# EAGLE design Teensy_FrequencyShield_2ch_slim (EAGLE 6.6.0)
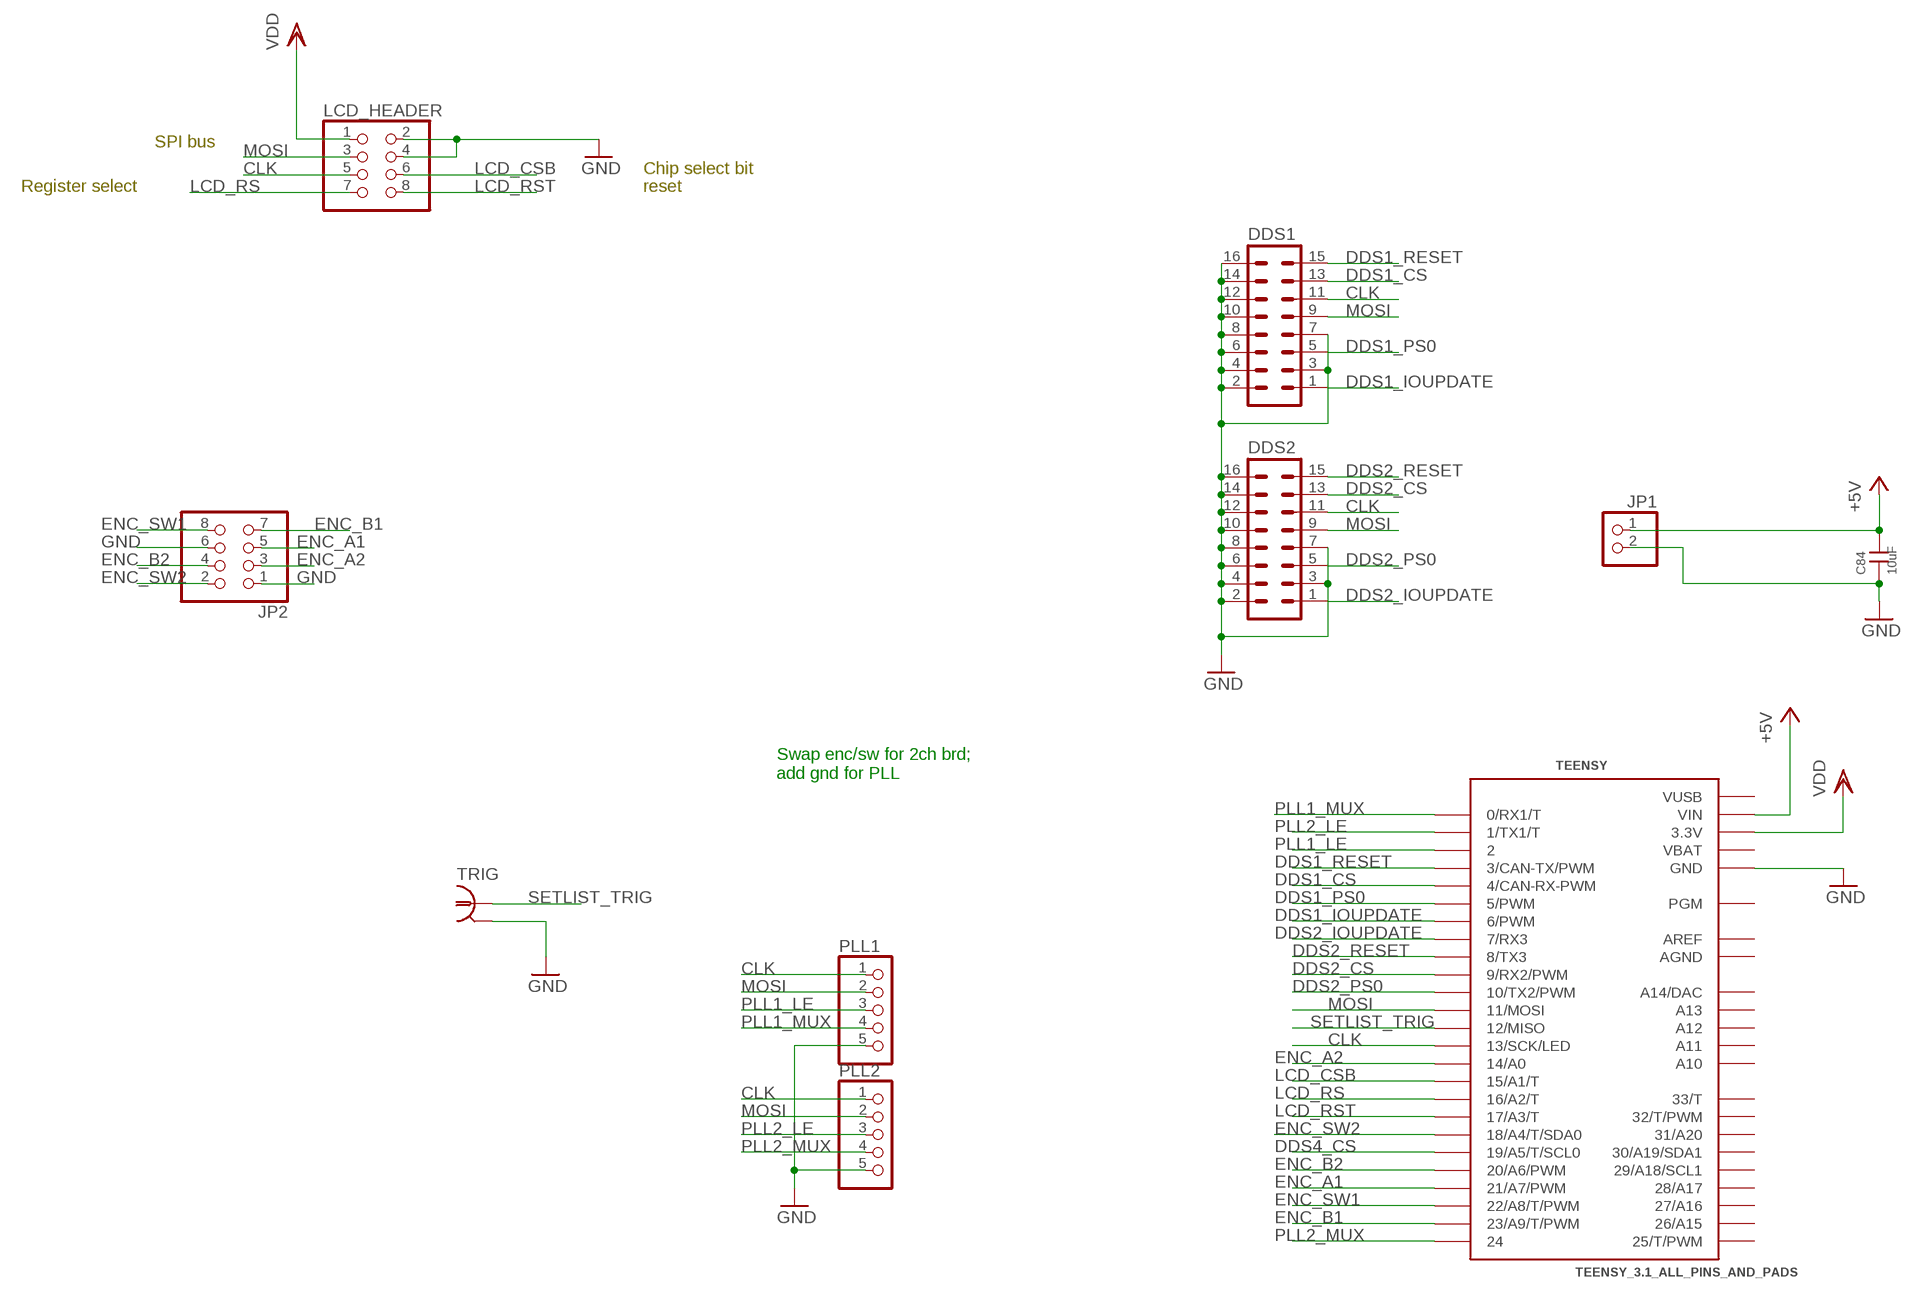
[diagram p0: schematic, sheet 1]

## Parts
C84  10uF  CAP0805  [0805]
DDS1  ML16  [ML16]
DDS2  ML16  [ML16]
JP1  PINHD-1X2  [1X02]
JP2  PINHD-2X4-SHROUD  [ML08]
LCD_HEADER  PINHD-2X4-SHROUD  [ML08]
PLL1  PINHD-1X5  [1X05]
PLL2  PINHD-1X5  [1X05]
TEENSY  TEENSY_3.1_ALL_PINS_AND_PADS  [TEENSY_3.1_ALLPINS]
TRIG  BNC-H  [BNC90]

## Nets
+5V: C84.2 JP1.1 TEENSY.VIN
CLK: DDS1.11 DDS2.11 LCD_HEADER.5 PLL1.1 PLL2.1 TEENSY.13(13/SCK/LED)
DDS1_CS: DDS1.13 TEENSY.4(4/CAN-RX-PWM)
DDS1_IOUPDATE: DDS1.1 TEENSY.6(6/PWM)
DDS1_PS0: DDS1.5 TEENSY.5(5/PWM)
DDS1_RESET: DDS1.15 TEENSY.3(3/CAN-TX/PWM)
DDS2_CS: DDS2.13 TEENSY.9(9/RX2/PWM)
DDS2_IOUPDATE: DDS2.1 TEENSY.7(7/RX3)
DDS2_PS0: DDS2.5 TEENSY.10(10/TX2/PWM)
DDS2_RESET: DDS2.15 TEENSY.8(8/TX3)
DDS4_CS: TEENSY.19/A5(19/A5/T/SCL0)
ENC_A1: JP2.5 TEENSY.21/A7(21/A7/PWM)
ENC_A2: JP2.3 TEENSY.14/A0
ENC_B1: JP2.7 TEENSY.23/A9(23/A9/T/PWM)
ENC_B2: JP2.4 TEENSY.20/A6(20/A6/PWM)
ENC_SW1: JP2.8 TEENSY.22/A8(22/A8/T/PWM)
ENC_SW2: JP2.2 TEENSY.18/A4(18/A4/T/SDA0)
EROU: LCD_HEADER.1 TEENSY.3.3V TEENSY.3.3V1(3.3V) TEENSY.3.3V2(3.3V) ; supply symbol labelled VDD
GND: C84.1 DDS1.2 DDS1.3 DDS1.4 DDS1.6 DDS1.7 DDS1.8 DDS1.10 DDS1.12 DDS1.14 DDS1.16 DDS2.2 DDS2.3 DDS2.4 DDS2.6 DDS2.7 DDS2.8 DDS2.10 DDS2.12 DDS2.14 DDS2.16 JP1.2 JP2.1 JP2.6 LCD_HEADER.2 LCD_HEADER.4 PLL1.5 PLL2.5 TEENSY.GND TEENSY.GND1(GND) TEENSY.GND2(GND) TRIG.2
LCD_CSB: LCD_HEADER.6 TEENSY.15/A1(15/A1/T)
LCD_RS: LCD_HEADER.7 TEENSY.16/A2(16/A2/T)
LCD_RST: LCD_HEADER.8 TEENSY.17/A3(17/A3/T)
MOSI: DDS1.9 DDS2.9 LCD_HEADER.3 PLL1.2 PLL2.2 TEENSY.11(11/MOSI)
PLL1_LE: PLL1.3 TEENSY.2
PLL1_MUX: PLL1.4 TEENSY.0(0/RX1/T)
PLL2_LE: PLL2.3 TEENSY.1(1/TX1/T)
PLL2_MUX: PLL2.4 TEENSY.24
SETLIST_TRIG: TEENSY.12(12/MISO) TRIG.1
Unconnected: TEENSY.25(25/T/PWM) TEENSY.26(26/A15) TEENSY.27(27/A16) TEENSY.28(28/A17) TEENSY.29(29/A18/SCL1) TEENSY.30(30/A19/SDA1) TEENSY.31(31/A20) TEENSY.32(32/T/PWM) TEENSY.33(33/T) TEENSY.A10 TEENSY.A11 TEENSY.A12 TEENSY.A13 TEENSY.A14(A14/DAC) TEENSY.PGM

## Notes on the sheet
- SPI bus
- Chip select bit
- Register select | reset
- Swap enc/sw for 2ch brd;
  add gnd for PLL

## Power pins joined to a net without a drawn wire
AGND: TEENSY.AGND
AREF: TEENSY.AREF
VBAT: TEENSY.VBAT
VUSB: TEENSY.VUSB

## Library data of the parts
C84 = rlc-jqi:CAP: SMT Capacitor; PARTNO: 1276-2890-1-ND
DDS1 DDS2 = mcu-accessories:ML16: HARTING 2x8 (16 pin) ribbon connector.; OC_FARNELL: unknown; OC_NEWARK: unknown
JP1 = pinhead:PINHD-1X2: PIN HEADER
JP2 LCD_HEADER = mcu-accessories:PINHD-2X4: PIN HEADER
PLL1 PLL2 = pinhead:PINHD-1X5: PIN HEADER
TEENSY = mcu-accessories:TEENSY_3.1_ALL_PINS_AND_PADS: Footprint for Teensy 3.1 board using all pads and all through-holes. Pads need a 2x7 0.1" SMD header.
TRIG = connector-jqi:BNC: BNC Connector.; DIGIKEY: 12345

## Board
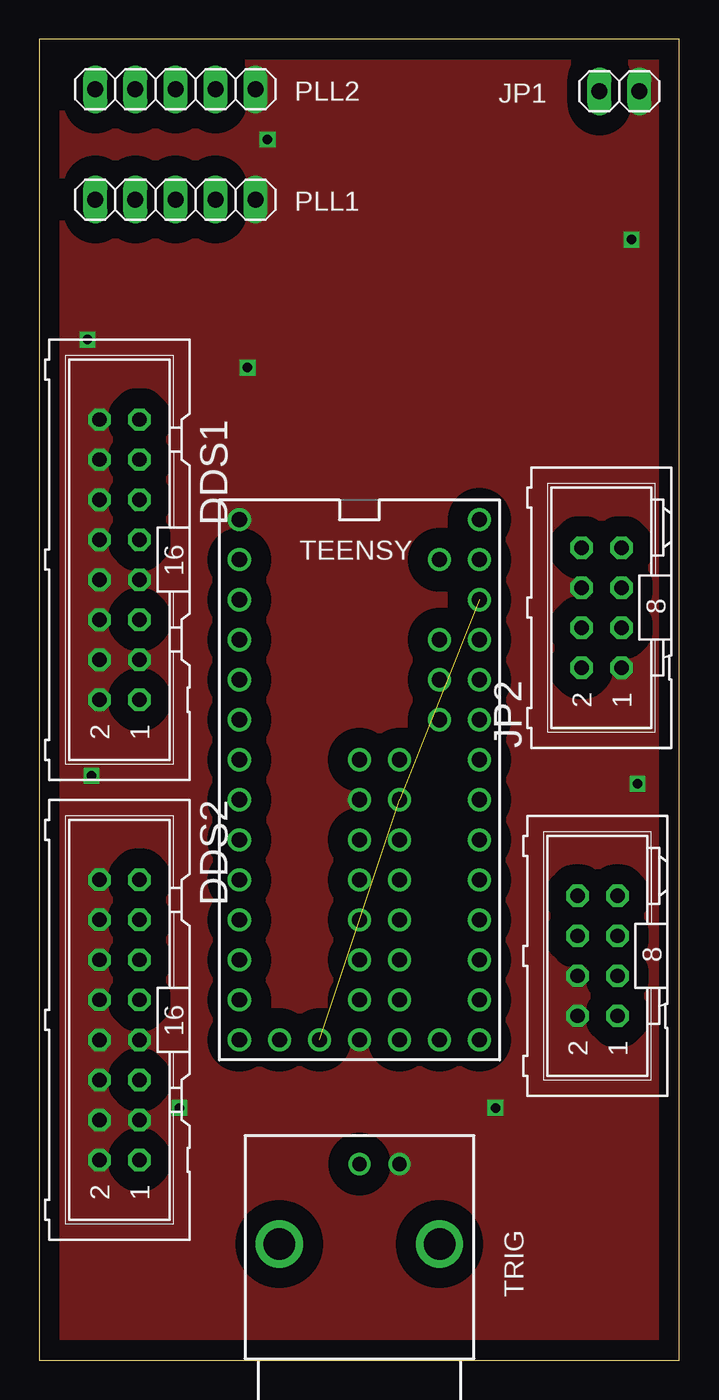
[diagram p1: board, top side]
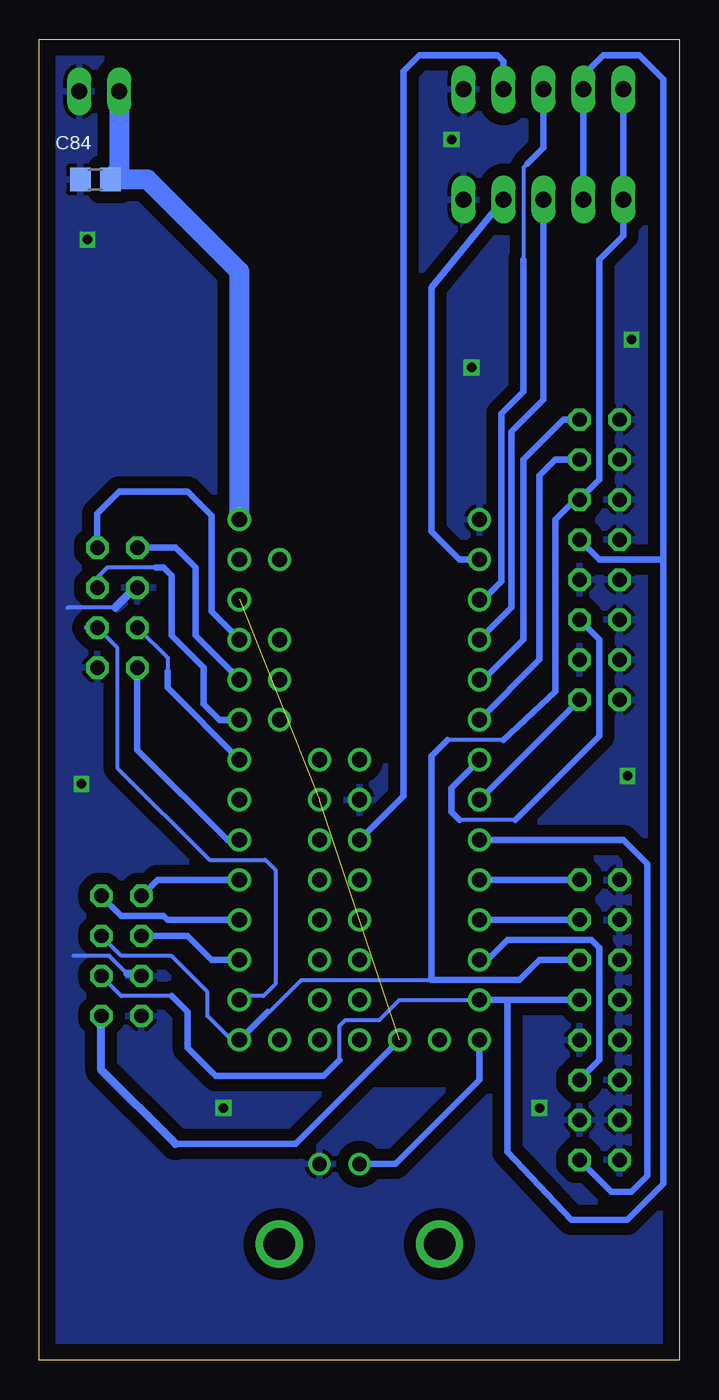
[diagram p2: board, bottom side, seen from below]

Size 40.64 x 83.82 mm. Coordinates in mm from the lower left corner, seen from the top.
Outline: 0,0 40.64,0 40.64,83.82 0,83.82 0,0
Copper layers (1*16): Top 0.035mm / dielectric 1.5mm / Bottom 0.035mm
Design rules "default": minimum track width 10mil, minimum drill 24mil, track to track 8mil, track to pad 8mil, pad to pad 8mil, via to via 8mil, smd to smd 8mil, copper to edge 40mil, drill to drill 8mil, minimum pad ring 10mil, minimum via ring 8mil, stop-mask expansion 4mil, vias tented up to drill 0mil, thermal gap 10mil

### Footprints (pad centres in the part's own frame; a part is rotated, then mirrored left to right if it is on the bottom)
0805 = smd 1.3 x 1.5: 1 -0.95,0; 2 0.95,0
ML16 = drill 0.914 octagon: 1 -8.89,-1.27; 2 -8.89,1.27; 3 -6.35,-1.27; 4 -6.35,1.27; 5 -3.81,-1.27; 6 -3.81,1.27; 7 -1.27,-1.27; 8 -1.27,1.27; 9 1.27,-1.27; 10 1.27,1.27; 11 3.81,-1.27; 12 3.81,1.27; 13 6.35,-1.27; 14 6.35,1.27; 15 8.89,-1.27; 16 8.89,1.27
1X02 = drill 1.016 long: 1 -1.27,0; 2 1.27,0
ML08 = drill 0.914 octagon: 1 -3.81,-1.143; 2 -3.81,1.397; 3 -1.27,-1.143; 4 -1.27,1.397; 5 1.27,-1.143; 6 1.27,1.397; 7 3.81,-1.143; 8 3.81,1.397
1X05 = drill 1.016 long: 1 -5.08,0; 2 -2.54,0; 3 0,0; 4 2.54,0; 5 5.08,0
TEENSY_3.1_ALLPINS = drill 0.965: 0 -7.62,15.24; 1 -7.62,12.7; 2 -7.62,10.16; 3 -7.62,7.62; 3.3V 7.62,12.7; 3.3V1 -2.54,-15.24; 3.3V2 2.54,0; 4 -7.62,5.08; 5 -7.62,2.54; 6 -7.62,0; 7 -7.62,-2.54; 8 -7.62,-5.08; 9 -7.62,-7.62; 10 -7.62,-10.16; 11 -7.62,-12.7; 12 -7.62,-15.24; 13 7.62,-15.24; 14/A0 7.62,-12.7; 15/A1 7.62,-10.16; 16/A2 7.62,-7.62; 17/A3 7.62,-5.08; 18/A4 7.62,-2.54; 19/A5 7.62,0; 20/A6 7.62,2.54; 21/A7 7.62,5.08; 22/A8 7.62,7.62; 23/A9 7.62,10.16; 24 0,-2.54; 25 0,-5.08; 26 0,-7.62; 27 0,-10.16; 28 0,-12.7; 29 2.54,-12.7; 30 2.54,-10.16; 31 2.54,-7.62; 32 2.54,-5.08; 33 2.54,-2.54; A10 5.08,7.62; A11 5.08,5.08; A12 0,2.54; A13 2.54,2.54; A14 5.08,-15.24; AGND 7.62,15.24; AREF 5.08,10.16; GND -7.62,17.78; GND1 0,-15.24; GND2 0,0; PGM 2.54,-15.24; VBAT -5.08,-15.24; VIN 7.62,17.78; VUSB 5.08,15.24
BNC90 = drill 0.9 pad 1.27: 1 0,-5.08; 2 -2.54,-5.08 | drill 2 pad 2.032: ANCHOR1 -5.08,0; ANCHOR2 5.08,0

### Placement (x,y rotation side)
C84  37.08,74.93 0 bottom
DDS1  5.08,50.8 90 top
DDS2  5.08,21.59 90 top
JP1  36.83,80.52 0 top
JP2  35.81,47.75 90 top
LCD_HEADER  35.56,25.65 90 top
PLL1  8.64,73.66 0 top
PLL2  8.64,80.64 0 top
TEENSY  20.32,35.56 0 top
TRIG  20.32,7.37 180 top

### Tracks (layer width: path | path; a pad name or v marks a point on that pad's centre or on a via)
+5V
  Bottom 1.27: TEENSY.VIN 27.94,69.09 33.78,74.93 C84.2 35.56,75.5 JP1.1
CLK
  Bottom 0.254: 11.18,39.37 14.73,39.37 | TEENSY.13 28.45,20.32 29.97,21.84 29.97,23.37 32.26,25.65 35.43,25.65 LCD_HEADER.5 | 26.16,22.1 26.04,22.1 24,24.13 15.75,24.13
  Bottom 0.406: PLL2.1 PLL1.1 3.56,71.37 5.08,69.85 5.08,55.88 DDS1.11 6.6,54.61 7.87,53.34 7.87,42.42 11.18,39.37 | DDS2.11 8.89,25.4 10.16,24.13 15.75,24.13 15.75,38.35 14.73,39.37 | 26.16,22.1 TEENSY.13
DDS1_CS
  Bottom 0.406: TEENSY.4 8.89,44.45 8.89,56.13 7.87,57.15 DDS1.13
DDS1_IOUPDATE
  Bottom 0.406: DDS1.1 TEENSY.6
DDS1_PS0
  Bottom 0.254: 10.41,34.29 13.97,34.29
  Bottom 0.406: DDS1.5 5.08,45.72 5.08,39.62 10.41,34.29 | 13.97,34.29 14.48,34.8 14.48,36.32 TEENSY.5
DDS1_RESET
  Bottom 0.406: TEENSY.3 12.45,43.18 9.91,45.72 9.91,57.15 7.37,59.69 DDS1.15
DDS2_CS
  Bottom 0.406: DDS2.13 TEENSY.9
DDS2_IOUPDATE
  Bottom 0.406: TEENSY.7 3.56,33.02 2.03,31.5 2.03,11.68 3.05,10.67 4.32,10.67 DDS2.1
DDS2_PS0
  Bottom 0.406: TEENSY.10 12.19,25.4 10.92,26.67 5.59,26.67 5.08,26.16 5.08,19.05 DDS2.5
DDS2_RESET
  Bottom 0.406: DDS2.15 TEENSY.8
ENC_A1
  Bottom 0.254: 33.27,50.29 36.32,50.29 36.96,49.66 JP2.5
  Bottom 0.406: 28.19,40.64 TEENSY.21/A7 29.21,40.64 30.23,41.66 30.23,43.94 32.26,45.97 32.26,49.78 32.77,50.29 33.27,50.29
ENC_A2
  Bottom 0.254: JP2.3 35.69,45.21 35.69,37.59 29.84,31.75 26.29,31.75 25.65,31.12 25.65,23.88 26.42,23.11 27.69,23.11 TEENSY.14/A0
  Bottom 0.406: 37.59,46.48 JP2.3
ENC_B1
  Bottom 0.406: TEENSY.23/A9 29.72,47.5 29.72,53.59 31.24,55.12 35.56,55.12 36.96,53.72 JP2.7
ENC_B2
  Bottom 0.254: JP2.4 32.51,44.58 32.51,43.69
  Bottom 0.406: 32.51,43.69 32.51,42.67 TEENSY.20/A6
ENC_SW1
  Bottom 0.406: TEENSY.22/A8 30.73,45.97 30.73,50.29 32,51.56 JP2.8
ENC_SW2
  Bottom 0.406: JP2.2 34.42,38.73 28.7,33.02 TEENSY.18/A4
EROU  (2 unrouted)
  Bottom 0.406: TEENSY.3.3V1 24.38,13.72 32,13.72
  Bottom 0.508: 32,13.72 36.7,18.41 LCD_HEADER.1
GND  (via drill 0.6)
  Bottom 0.254: 35.05,24.51 36.2,25.65 38.48,25.65 | 34.54,48.77 34.8,48.77 | 35.81,47.75 38.86,47.75
  Bottom 0.508: 34.29,24.51 35.05,24.51 | 34.8,48.77 35.81,47.75
  other vias: 13.21,62.99 3.3,37.08 37.59,71.12 37.97,36.58 28.96,16 8.89,16 3.05,64.77 14.48,77.47
  pour Bottom (isolate 0.762): -2.54,83.82 43.18,83.82 43.18,0 -2.54,0
  pour Top (isolate 1.27, no thermals): -2.54,83.82 43.18,83.82 43.18,0 -2.54,0
LCD_CSB
  Bottom 0.406: TEENSY.15/A1 29.72,25.4 31.24,26.92 LCD_HEADER.6
LCD_RS
  Bottom 0.406: TEENSY.16/A2 32.51,27.94 32.77,28.19 35.43,28.19 LCD_HEADER.7
LCD_RST
  Bottom 0.406: TEENSY.17/A3 33.15,30.48 LCD_HEADER.8
MOSI
  Bottom 0.254: 36.7,24.26 LCD_HEADER.3 35.43,23.11 32.26,23.11 | 21.59,19.05 21.59,21.21 21.21,21.59 19.05,21.59 17.78,22.86 TEENSY.11
  Bottom 0.406: PLL1.2 PLL2.2 6.1,81.53 4.83,82.8 2.54,82.8 1.02,81.28 1.02,50.8 | DDS2.9 10.92,22.86 | 10.92,22.86 TEENSY.11 | DDS1.9 5.08,50.8 1.02,50.8 | 21.59,19.05 22.61,18.03 29.46,18.03 31.24,19.81 31.24,22.1 32.26,23.11 | 10.92,22.86 10.92,13.21 6.86,8.89 3.3,8.89 1.02,11.18 1.02,50.8
N$1
  cutout Bottom: 13.72,24.38 25.4,24.38 25.4,17.53 13.72,17.53
PLL1_LE
  Bottom 0.406: TEENSY.2 10.67,47.75 10.67,58.93 8.64,60.96 PLL1.3
PLL1_MUX
  Bottom 0.406: TEENSY.0 13.97,50.8 15.75,52.58 15.75,68.07 PLL1.4
PLL2_LE
  Bottom 0.254: 9.65,75.95 9.91,75.69 9.91,69.85
  Bottom 0.406: PLL2.3 8.64,76.96 9.65,75.95 | 9.91,69.85 9.91,61.47 11.3,60.07 11.3,49.4 12.45,48.26 TEENSY.1
PLL2_MUX
  Bottom 0.406: TEENSY.24 17.53,35.81 17.53,81.79 16.51,82.8 11.56,82.8 11.18,82.42 PLL2.4
SETLIST_TRIG
  Bottom 0.406: TEENSY.12 12.7,17.78 18.03,12.45 TRIG.1